# EAGLE design IndyShield (EAGLE 9.5.1)
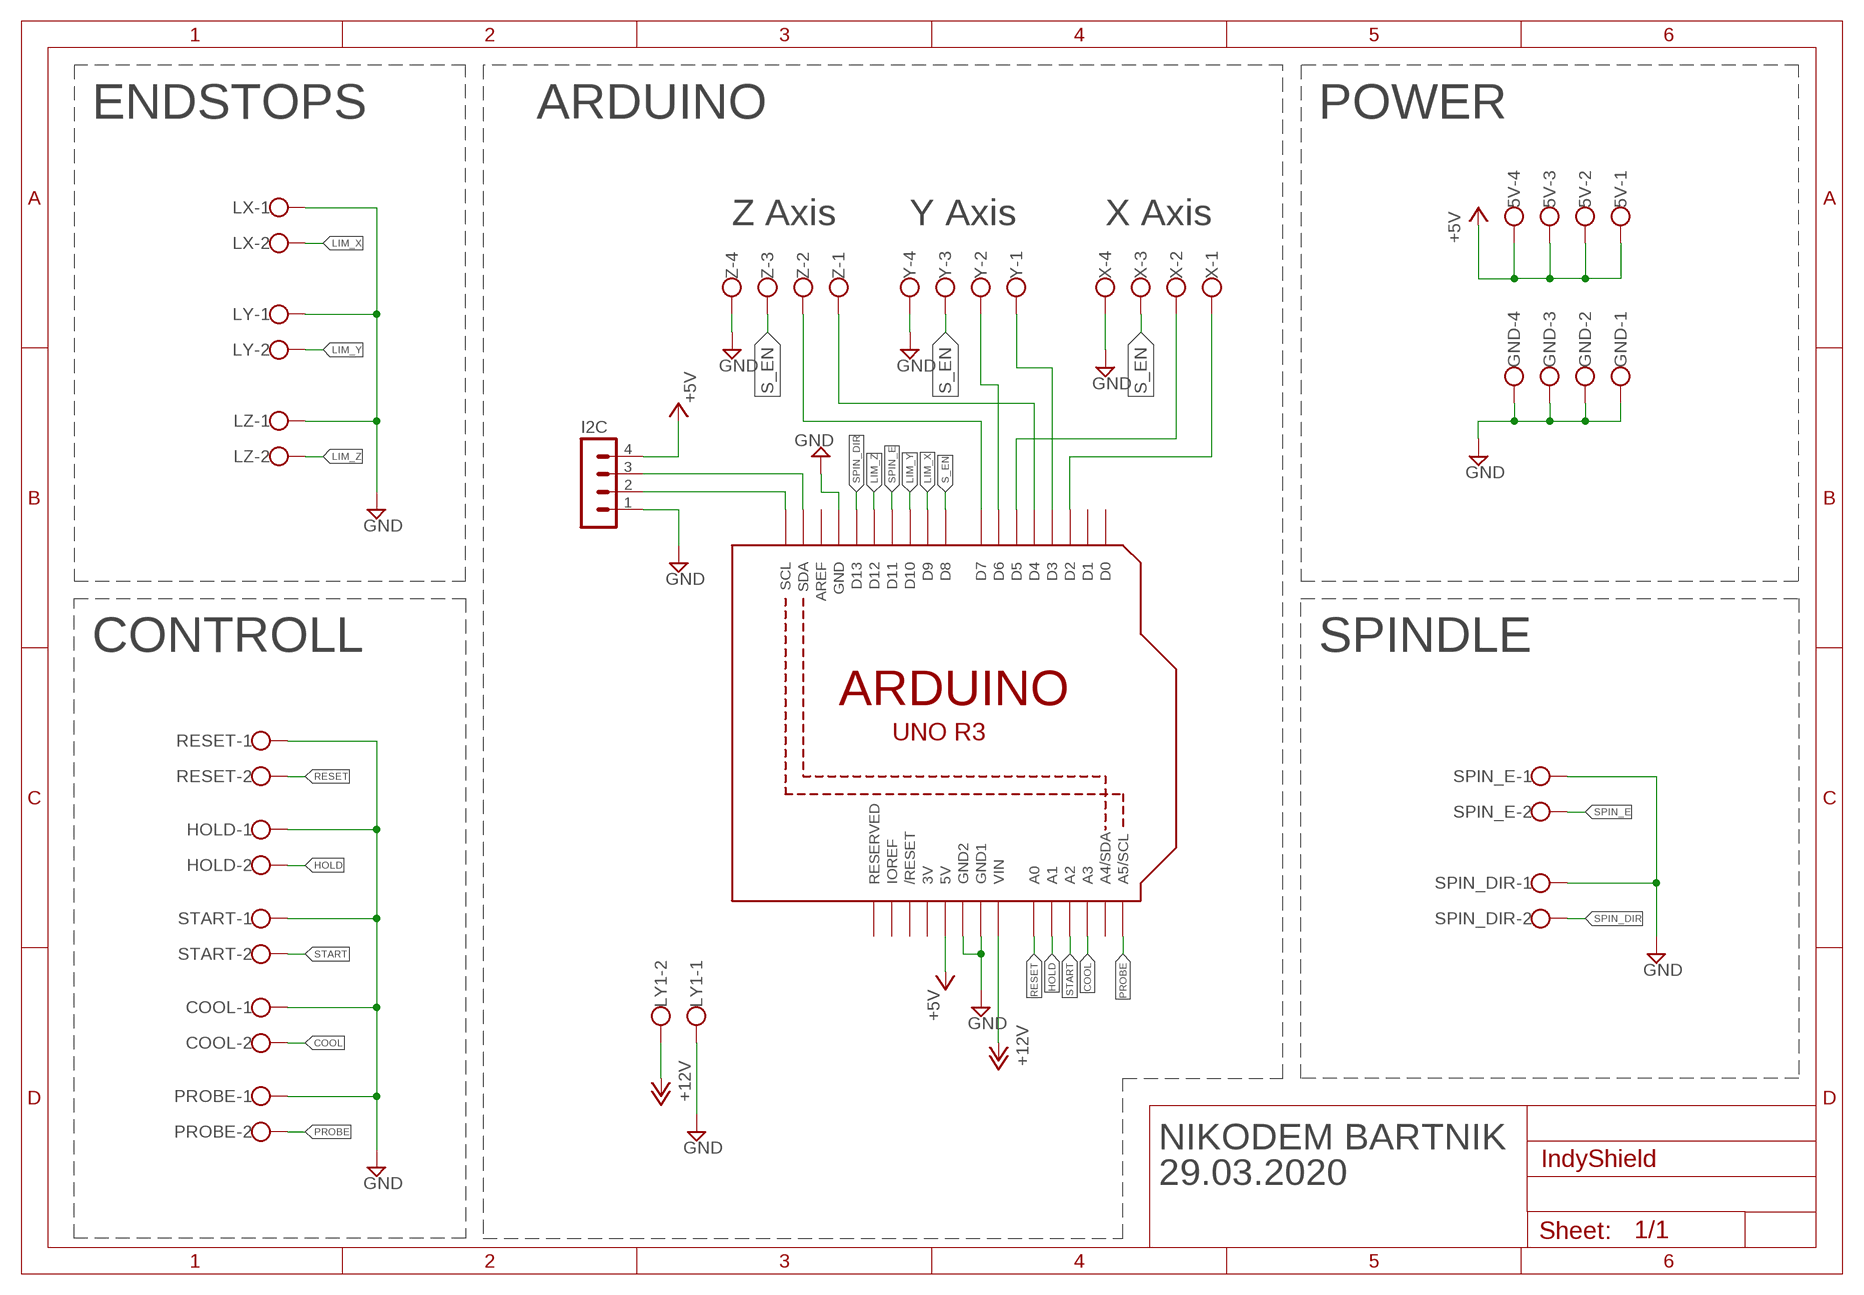
[diagram p0: schematic, sheet 1]

## Parts
5V  W237-4  [W237-4]
COOL  W237-102  [W237-102]
GND  W237-4  [W237-4]
HOLD  W237-102  [W237-102]
I2C  MA04-1  [MA04-1]
LX  W237-102  [W237-102]
LY  W237-102  [W237-102]
LY1  W237-102  [W237-102]
LZ  W237-102  [W237-102]
PROBE  W237-102  [W237-102]
RESET  W237-102  [W237-102]
SPIN_DIR  W237-102  [W237-102]
SPIN_E  W237-102  [W237-102]
START  W237-102  [W237-102]
U1  ARDUINOR3-BPLACE  [ARDUINOR3-BPLACE]
X  W237-4  [W237-4]
Y  W237-4  [W237-4]
Z  W237-4  [W237-4]

## Nets
+5V: 5V.1 5V.2 5V.3 5V.4 I2C.4 U1.5V
+12V: LY1.2 U1.VIN
COOL: COOL.2 U1.A3
GND: COOL.1 GND.1 GND.2 GND.3 GND.4 HOLD.1 I2C.1 LX.1 LY1.1 LY.1 LZ.1 PROBE.1 RESET.1 SPIN_DIR.1 SPIN_E.1 START.1 U1.GND U1.GND1 U1.GND2 X.4 Y.4 Z.4
HOLD: HOLD.2 U1.A1
LIM_X: LX.2 U1.D9
LIM_Y: LY.2 U1.D10
LIM_Z: LZ.2 U1.D12
N$1: U1.D5 X.2
N$2: U1.D2 X.1
N$3: U1.D6 Y.2
N$4: U1.D3 Y.1
N$5: U1.D7 Z.2
N$6: U1.D4 Z.1
N$9: I2C.3 U1.SDA
N$10: I2C.2 U1.SCL
PROBE: PROBE.2 U1.A5(A5/SCL)
RESET: RESET.2 U1.A0
S_EN: U1.D8 X.3 Y.3 Z.3
SPIN_DIR: SPIN_DIR.2 U1.D13
SPIN_E: SPIN_E.2 U1.D11
START: START.2 U1.A2
Unconnected: U1.A4(A4/SDA) U1.AREF U1.D0 U1.D1 U1.IOREF U1.RESERVED U1.RESET(/RESET)

## Notes on the sheet
- ENDSTOPS | ARDUINO | POWER
- Z Axis | Y Axis | X Axis
- CONTROLL | SPINDLE
- NIKODEM BARTNIK
- 29.03.2020

## Power pins joined to a net without a drawn wire
3V: U1.3V

## Library data of the parts
5V GND X Y Z = con-wago-500:W237-4: WAGO SCREW CLAMP; OC_FARNELL: unknown; OC_NEWARK: unknown
COOL HOLD LX LY LY1 LZ PROBE RESET SPIN_DIR SPIN_E START = con-wago-500:W237-102: WAGO SCREW CLAMP; MPN: 237-102; OC_FARNELL: unknown; OC_NEWARK: 70K9898
I2C = con-lstb:MA04-1: PIN HEADER; OC_FARNELL: unknown; OC_NEWARK: unknown
U1 = adafruit:ARDUINOR3: This is a new object for the new Arduino R3 - with extra pins that you may want to use (such as IOref, and duplicated A4/A5

## Board
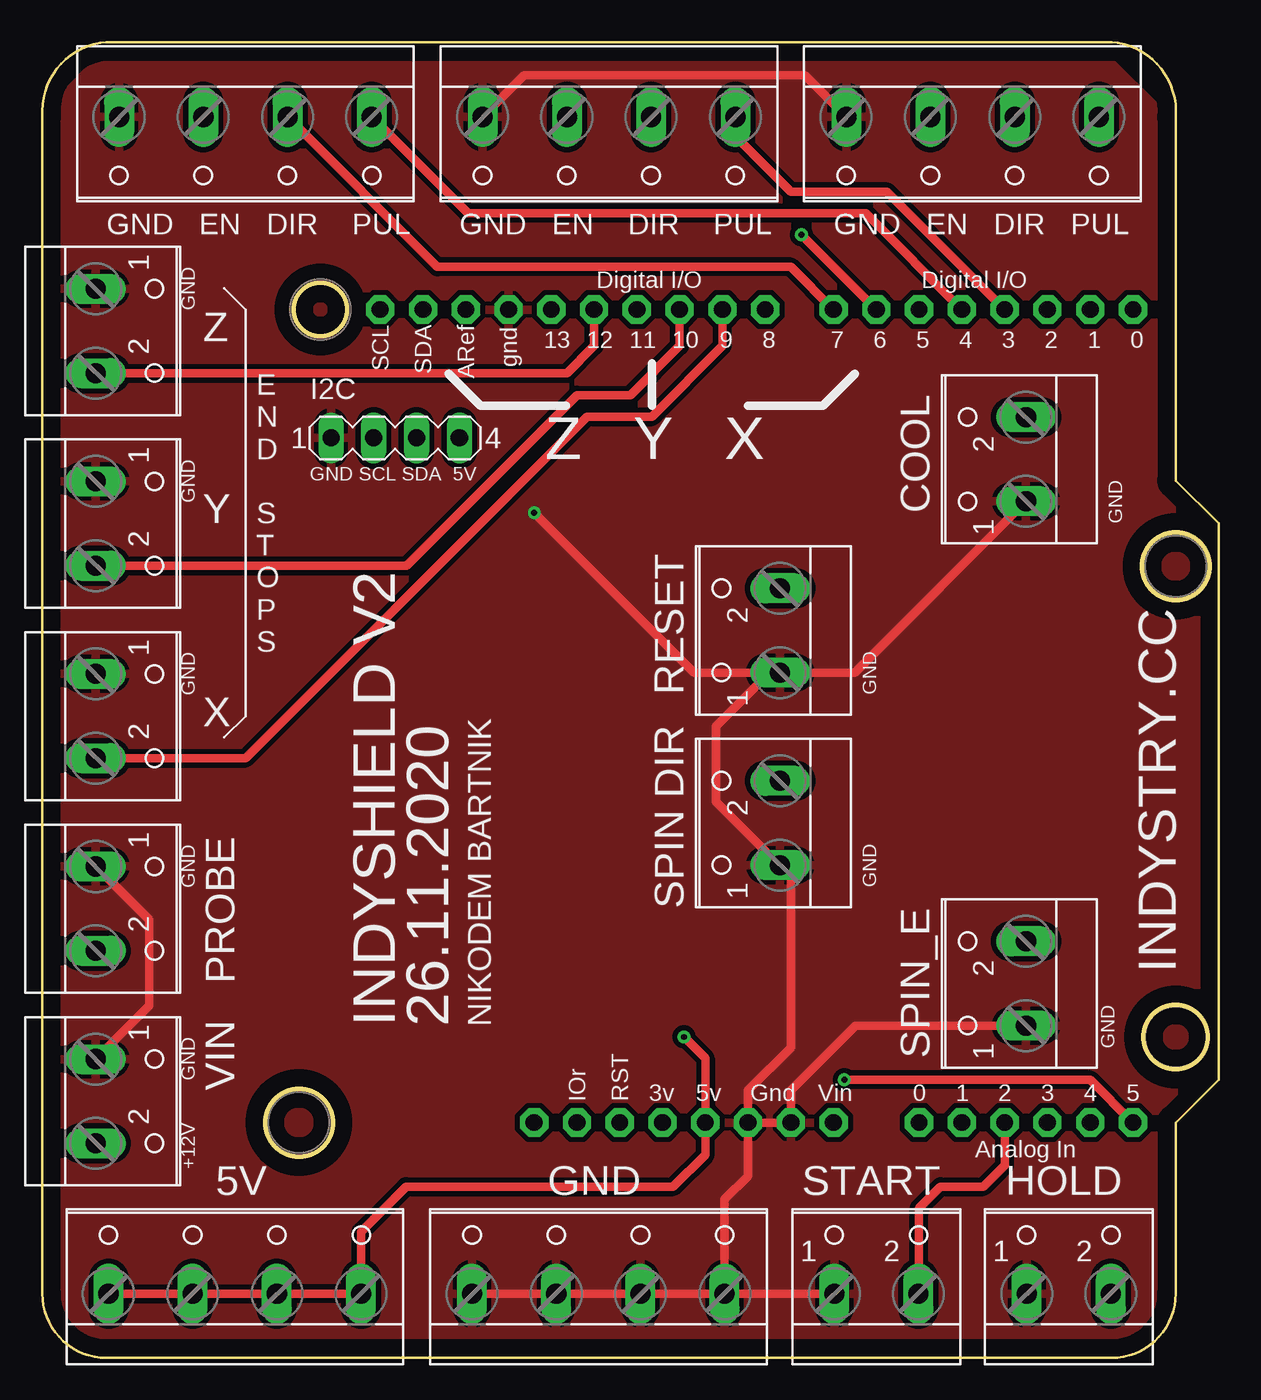
[diagram p1: board, top side]
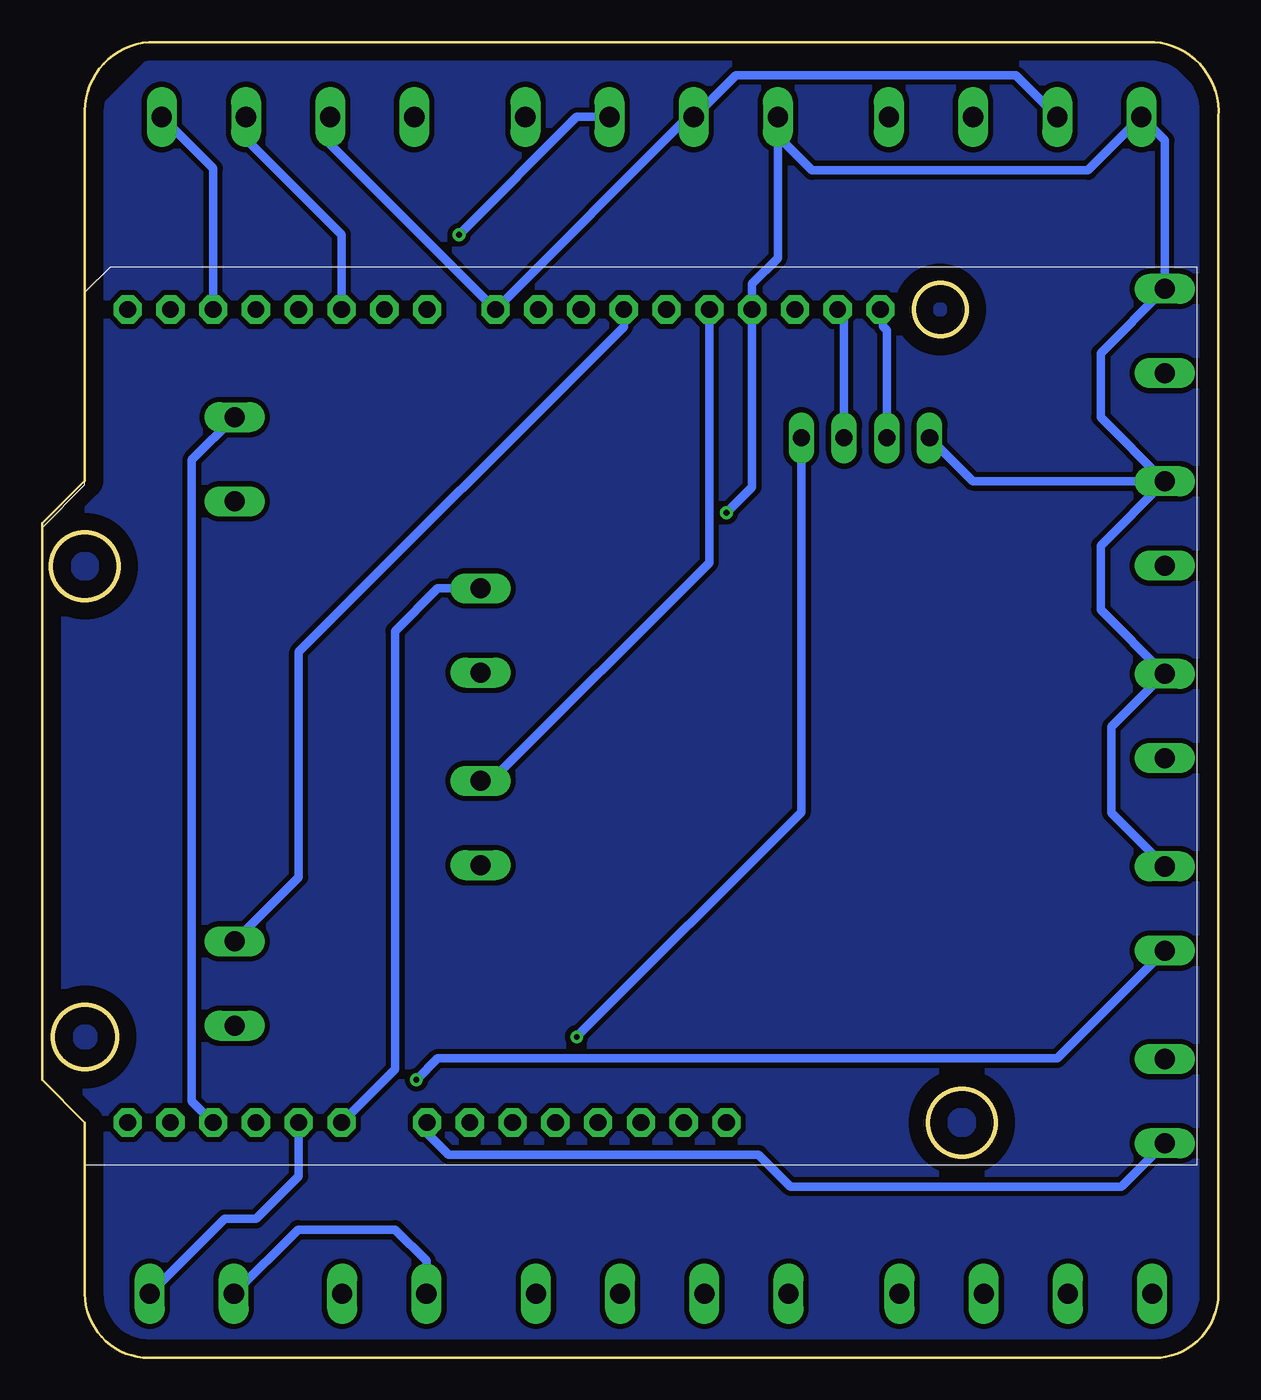
[diagram p2: board, bottom side, seen from below]

Size 69.86 x 78.1 mm. Coordinates in mm from the lower left corner, seen from the top.
Outline: 0.01,3.81 0.01,73.66 arc-90 3.82,78.1 63.51,78.1 arc-90 67.32,73.66 67.32,52.07 69.86,49.53 69.86,16.51 67.32,13.97 67.32,3.81 arc-90 63.51,0 3.82,0 arc-90 0.01,3.81
Outline: circle at 16.52,62.23 radius 1.57
Outline: circle at 67.32,46.99 radius 2.01
Outline: circle at 67.32,19.05 radius 1.91
Outline: circle at 15.25,13.97 radius 2.01
Copper layers (1*16): Top 0.035mm / dielectric 1.5mm / Bottom 0.035mm
Design rules "default": minimum track width 6mil, minimum drill 0.35mm, track to track 6mil, track to pad 6mil, pad to pad 6mil, via to via 6mil, smd to smd 6mil, copper to edge 40mil, drill to drill 6mil, minimum pad ring 10mil, minimum via ring 8mil, stop-mask expansion 4mil, vias tented up to drill 0mil, thermal gap 10mil

### Footprints (pad centres in the part's own frame; a part is rotated, then mirrored left to right if it is on the bottom)
W237-4 = drill 1.194 long: 1 -7.5,-1.27; 2 -2.5,-1.27; 3 2.5,-1.27; 4 7.5,-1.27
W237-102 = drill 1.194 long: 1 -2.5,-1.27; 2 2.5,-1.27
MA04-1 = drill 1.016 long: 1 -3.81,0; 2 -1.27,0; 3 1.27,0; 4 3.81,0
ARDUINOR3-BPLACE = drill 1 pad 1.676 octagon: 3V 35.56,2.54; 5V 38.1,2.54; A0 50.8,2.54; A1 53.34,2.54; A2 55.88,2.54; A3 58.42,2.54; A4 60.96,2.54; A5 63.5,2.54; AREF 23.876,50.8; D0 63.5,50.8; D1 60.96,50.8; D2 58.42,50.8; D3 55.88,50.8; D4 53.34,50.8; D5 50.8,50.8; D6 48.26,50.8; D7 45.72,50.8; D8 41.656,50.8; D9 39.116,50.8; D10 36.576,50.8; D11 34.036,50.8; D12 31.496,50.8; D13 28.956,50.8; GND 26.416,50.8; GND1 43.18,2.54; GND2 40.64,2.54; IOREF 30.48,2.54; RESERVED 27.94,2.54; RESET 33.02,2.54; SCL 18.796,50.8; SDA 21.336,50.8; VIN 45.72,2.54

### Placement (x,y rotation side)
5V  11.44,5.08 0 top
COOL  57.16,53.34 90 top
GND  33.03,5.08 0 top
HOLD  60.97,5.08 0 top
I2C  20.97,54.61 0 top
LX  4.46,38.1 270 top
LY  4.46,49.53 270 top
LY1  4.46,15.24 270 top
LZ  4.46,60.96 270 top
PROBE  4.46,26.67 270 top
RESET  42.56,43.18 90 top
SPIN_DIR  42.56,31.75 90 top
SPIN_E  57.16,22.23 90 top
START  49.54,5.08 0 top
U1  1.28,11.43 0 top
X  55.26,72.39 180 top
Y  33.67,72.39 180 top
Z  12.08,72.39 180 top

### Tracks (layer width: path | path; a pad name or v marks a point on that pad's centre or on a via)
+5V  (via drill 0.35)
  Top 0.508: 5V.1 5V.2 5V.3 5V.4 18.94,7.5 21.6,10.16 37.48,10.16 39.38,12.07 U1.5V 39.38,17.78 v38.11,19.05
  Bottom 0.508: I2C.4 24.78,32.38 v38.11,19.05
+12V
  Bottom 0.508: U1.VIN 47,13.34 45.73,12.07 27.32,12.07 25.41,10.16 5.77,10.16 LY1.2
COOL
  Bottom 0.508: COOL.2 60.97,53.3 60.97,15.24 U1.A3
GND  (via drill 0.35)
  Top 0.508: GND.1 GND.2 GND.3 GND.4 | GND.4 40.53,9.41 41.92,10.8 U1.GND2 | U1.GND2 U1.GND1 44.46,15.88 48.31,19.73 SPIN_E.1 | U1.GND2 41.92,15.88 44.46,18.41 44.46,28.62 SPIN_DIR.1 43.79,29.25 40.02,33.02 40.02,37.51 43.19,40.68 RESET.1 | RESET.1 48.27,40.68 COOL.1 | v29.22,50.16 38.71,40.68 RESET.1 | GND.4 START.1 | Y.4 28.63,76.12 45.29,76.12 X.4 | LY1.1 6.36,20.91 6.36,25.99 PROBE.1
  Bottom 0.508: HOLD.1 54.66,7.62 48.91,7.62 47.04,5.75 START.1 | 3.23,29.21 PROBE.1 6.36,32.34 6.36,37.47 3.21,40.62 | v29.22,50.16 27.7,51.69 U1.GND 27.7,63.75 26.17,65.28 Y.4 26.17,72.51 24.14,70.49 7.75,70.49 Z.4 3.19,72.27 LZ.1 7,59.65 7,55.84 3.21,52.05 | 3.21,52.05 LY.1 7,48.22 7,44.41 3.21,40.62 | 3.21,40.62 LX.1 | I2C.1 14.6,52.05 3.21,52.05
  pour Top (isolate 0.305): 0.65,3.18 0.65,74.29 3.82,77.47 62.88,77.47 66.69,73.66 66.69,51.44 69.23,48.9 69.23,16.51 66.69,13.97 66.69,3.18 64.15,0.63 3.19,0.63
HOLD
  Bottom 0.508: HOLD.2 59.03,8.25 57.16,8.25 54.62,10.8 U1.A1
LIM_X
  Top 0.508: LX.2 12.08,35.6 32.36,55.88 36.21,55.88 40.4,60.07 U1.D9
LIM_Y
  Top 0.508: LY.2 21.64,47.03 31.76,57.15 34.94,57.15 37.86,60.07 U1.D10
LIM_Z
  Top 0.508: LZ.2 31.17,58.46 32.71,60.01 32.78,60.07 U1.D12
N$1
  Bottom 0.508: U1.D5 52.08,66.68 57.76,72.35 X.2
N$2
  Bottom 0.508: U1.D2 59.7,70.6 X.1
N$3  (via drill 0.35)
  Top 0.508: U1.D6 v45.1,66.68
  Bottom 0.508: v45.1,66.68 38.11,73.66 Y.2
N$4
  Top 0.508: U1.D3 50.18,69.22 44.46,69.22 41.17,72.51 Y.1
N$5
  Top 0.508: U1.D7 44.46,64.77 23.47,64.77 Z.2
N$6
  Top 0.508: U1.D4 48.91,67.94 25.29,67.94 Z.1
N$9
  Bottom 0.508: I2C.3 22.24,61.85 U1.SDA
N$10
  Bottom 0.508: I2C.2 19.7,61 19.93,61.23 19.93,62.08 U1.SCL
PROBE  (via drill 0.35)
  Top 0.508: U1.A5 62.24,16.51 v47.64,16.51
  Bottom 0.508: v47.64,16.51 46.37,17.78 9.58,17.78 PROBE.2
RESET
  Bottom 0.508: U1.A0 48.91,17.14 48.91,43.14 46.37,45.68 RESET.2
S_EN
  Bottom 0.508: X.3 52.76,72.05 U1.D8 31.51,73.66 Y.3 31.13,73.66 28.66,76.12 12.04,76.12 Z.3
SPIN_DIR
  Bottom 0.508: SPIN_DIR.2 43.19,34.25 30.24,47.2 U1.D13
SPIN_E
  Bottom 0.508: SPIN_E.2 54.62,28.54 54.62,41.91 35.32,61.21 U1.D11
START
  Top 0.508: START.2 52.08,3.85 52.08,8.89 53.35,10.16 55.89,10.16 57.16,11.43 U1.A2
VCC
  pour Bottom (isolate 0.305): 0.65,74.29 0.65,3.18 3.19,0.63 64.15,0.63 66.69,3.18 66.69,13.97 69.23,16.51 69.23,48.9 66.69,51.44 66.69,73.66 62.88,77.47 3.82,77.47

### Text on the board
tNames: GND EN DIR PUL | GND EN DIR PUL | GND EN DIR PUL | GND | Z | GND | Z Y X | GND SCL SDA 5V | COOL | Y | GND | GND | E / N / D / / S / T / O / P / S | RESET | GND | X | GND | GND | SPIN DIR | PROBE | INDYSTRY.CC | GND | INDYSHIELD V2 | 26.11.2020 | NIKODEM BARTNIK | GND | SPIN_E | VIN | +12V | 5V | GND | START | HOLD